# Altium schematic sheet 5_WIFI.schdoc
size 210 x 148 mm; Symbol: tv_muban1_1; Company: 嘉立创EDA; Version: V1.0; Page Size: A4; @Project Name: LCEDAsucaiku; @Update Date: 2026-05-01; @Create Date: 2026-03-27; @Page Name: WIFI; @Page Count: 8; @Page No: 5; @Update Time: 18:57:04; Color: #990000; Device: sucai_muban; @Board Name: tv基板; @Create Time: 22:34:03; @Schematic Name: Schematic1; @Assembly Variant: Basic; Border: 1; Title Block Position: 3; Size: A4; Width: 826; Height: 582; Region Start: 1; X Region Count: 6; Y Region Count: 4; Blade Width: 10; SheetNumber: 5; SheetTotal: 8
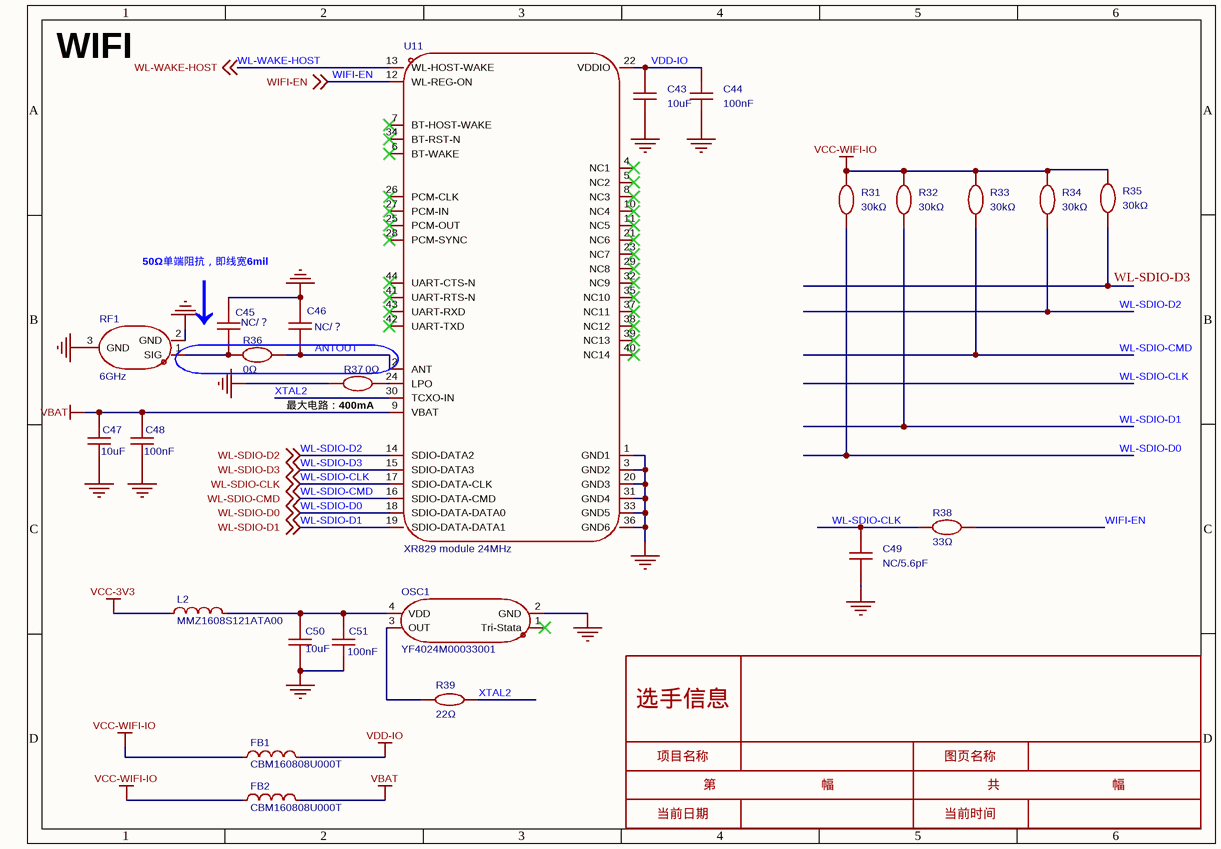
[diagram p0: 5_WIFI.schdoc]

## Parts
C43  10uF  [C0805]
C44  100nF  [C0402]
C45  NC/？  [C0402]
C46  NC/？  [C0402]
C47  10uF  [C0805]
C48  100nF  [C0402]
C49  NC/5.6pF  [C0402]
C50  10uF  [C0805]
C51  100nF  [C0402]
FB1  CBM160808U000T  [L0603]
FB2  CBM160808U000T  [L0603]
L2  MMZ1608S121ATA00  [L0603]
OSC1  YF4024M00033001  [OSC-SMD_4P-L3.2-W2.5-BL_1C210000BB0F]
R31  30kΩ  [R0402]
R32  30kΩ  [R0402]
R33  30kΩ  [R0402]
R34  30kΩ  [R0402]
R35  30kΩ  [R0402]
R36  0Ω  [R0402]
R37  0Ω  [R0402]
R38  33Ω  [R0402]
R39  22Ω  [R0402]
RF1  6GHz  [IPEX-SMD_BWIPX-1-001E]
U11  XR829 module 24MHz  [WIRELM-SMD_XR829-MODULE-24MHZ]

## Blocks framed on the sheet
↓: R36

## Nets
GND: C43.1 C44.1 C45.2 C46.2 C47.1 C48.1 C49.1 C50.1 C51.1 OSC1.2(GND) R37.1 RF1.2(GND) RF1.3(GND) U11.1(GND1) U11.3(GND2) U11.20(GND3) U11.31(GND4) U11.33(GND5) U11.36(GND6)
VBAT: C47.2 C48.2 FB2.2 U11.9(VBAT)
VCC-3V3: L2.1
VCC-WIFI-IO: FB1.1 FB2.1 R31.2 R32.2 R33.2 R34.2 R35.2
VDD-IO: C43.2 C44.2 FB1.2 U11.22(VDDIO)
ANTOUT: C46.1 R36.2 U11.2(ANT)
WIFI-EN: R38.1 U11.12(WL-REG-ON) ; off-sheet WIFI-EN
WL-SDIO-CLK: C49.2 R38.2 U11.17(SDIO-DATA-CLK) ; off-sheet WL-SDIO-CLK
WL-SDIO-CMD: R33.1 U11.16(SDIO-DATA-CMD) ; off-sheet WL-SDIO-CMD
WL-SDIO-D0: R31.1 U11.18(SDIO-DATA-DATA0) ; off-sheet WL-SDIO-D0
WL-SDIO-D1: R32.1 U11.19(SDIO-DATA-DATA1) ; off-sheet WL-SDIO-D1
WL-SDIO-D2: R34.1 U11.14(SDIO-DATA2) ; off-sheet WL-SDIO-D2
WL-SDIO-D3: R35.1 U11.15(SDIO-DATA3) ; off-sheet WL-SDIO-D3
WL-WAKE-HOST: U11.13(WL-HOST-WAKE) ; off-sheet WL-WAKE-HOST
XTAL2: R39.1 U11.30(TCXO-IN)
NetC45_1: C45.1 R36.1 RF1.1(SIG)
NetC50_2: C50.2 C51.2 L2.2 OSC1.4(VDD)
NetOSC1_3: OSC1.3(OUT) R39.2
NetR37_2: R37.2 U11.24(LPO)

Not connected (* = marked no-connect by the designer): OSC1 1(Tri-Stata)*; U11 4(NC1)* 5(NC2)* 6(BT-WAKE)* 7(BT-HOST-WAKE)* 8(NC3)* 10(NC4)* 11(NC5)* 21(NC6)* 23(NC7)* 25(PCM-OUT)* 26(PCM-CLK)* 27(PCM-IN)* 28(PCM-SYNC)* 29(NC8)* 32(NC9)* 34(BT-RST-N)* 35(NC10)* 37(NC11)* 38(NC12)* 39(NC13)* 40(NC14)* 41(UART-RTS-N)* 42(UART-TXD)* 43(UART-RXD)* 44(UART-CTS-N)*

## Notes on the sheet
- WIFI
- (near C45) 50Ω单端阻抗，即线宽6mil
- (near R37) 最大电路：400mA
- 选手信息
- 项目名称
- 第                              幅
- 图页名称
- 共                                幅
- 当前日期
- 当前时间

## Library data of the parts
C43 C47 C50 = CGA0805X5R106K500MT: 容值:10uF;精度:±10%;额定电压:50V;温度系数:X5R;; Manufacturer: HRE(芯声); 3D Model: 1ba041120af144c991958decab20d241聨0819f05c4eef4c71ace90d822a990e87; 3D Model Transform: 78.74,51.181,0,0,0,0,0,0.0005,0; Tolerance: ±10%; Voltage Rating: 50V; Temperature Coefficient: X5R; AddInBom: yes; ModelName: C0805_L2.0-W1.3-H1.3; Symbol: CGA0805X5R106K500MT; Device: CGA0805X5R106K500MT; LCSC Part Name: 10uF ±10% 50V; Supplier Part: C6119889; Manufacturer Part: CGA0805X5R106K500MT; Supplier Footprint: 0805; JLCPCB Part Class: Extended Part; Datasheet: https://item.szlcsc.com/datasheet/CGA0805X5R106K500MT/7062595.html; Supplier: LCSC; Value: 10uF; ConvertToPcb: yes; FootprintName: C0805
C44-C46 C48 C51 = CL05B104KO5NNNC: 容值:100nF;精度:±10%;额定电压:16V;温度系数:X7R;; Manufacturer: SAMSUNG(三星); 3D Model: 36a51122f27c49738f86b3bfa98863e0聨0819f05c4eef4c71ace90d822a990e87; 3D Model Transform: 39.37,19.685,0,0,0,0,0,0,0; Tolerance: ±10%; Voltage Rating: 16V; Temperature Coefficient: X7R; AddInBom: yes; ModelName: C0402_L1.0-W0.5-H0.5; Symbol: CL05B104KO5NNNC; Device: CL05B104KO5NNNC; LCSC Part Name: 100nF ±10% 16V; Manufacturer Part: CL05B104KO5NNNC; Supplier Footprint: 0402; JLCPCB Part Class: Basic Part; Datasheet: https://item.szlcsc.com/datasheet/CL05B104KO5NNNC/1877.html; Supplier: LCSC; ConvertToPcb: yes; FootprintName: C0402
  C44 C48 C51: Supplier Part: C1525; Value: 100nF
  C45 C46: Value: NC/？
C49 = CL05B104KO5NNNC: 容值:100nF;精度:±10%;额定电压:16V;温度系数:X7R;; Manufacturer: SAMSUNG(三星); AddInBom: yes; ModelId: 36a51122f27c49738f86b3bfa98863e0聨0819f05c4eef4c71ace90d822a990e87; ModelName: C0402_L1.0-W0.5-H0.5; ModelTransform: 39.37,19.685,0,0,0,0,0,0,0; Tolerance: ±10%; Voltage Rating: 16V; Temperature Coefficient: X7R; Symbol: CL05B104KO5NNNC; Device: CL05B104KO5NNNC; Value: NC/5.6pF; LCSC Part Name: 100nF ±10% 16V; ManufacturerPart: CL05B104KO5NNNC; Supplier Footprint: 0402; JLCPCB Part Class: Basic Part; Datasheet: https://item.szlcsc.com/datasheet/CL05B104KO5NNNC/1877.html; Supplier: LCSC; ConvertToPcb: yes; FootprintName: C0402
FB1 FB2 = CBM160808U000T: 阻抗@频率:0Ω@100MHz;直流电阻(DCR):10mΩ;; Manufacturer: FH(风华); AddInBom: yes; ModelId: 2bc5ec593d464d6ba9807aec0b5673c2聨0819f05c4eef4c71ace90d822a990e87; ModelName: L0603_L1.6-W0.8-H0.5_BEAD; ModelTransform: 62.992,31.496,0,180,0,0,0.094,0.629,0; DC Resistance(DCR): 10mΩ; Current Rating: 6A; Number of Circuits: 1; Symbol: CBM160808U000T; Device: CBM160808U000T; LCSC Part Name: 单路 0603磁珠 阻抗0Ω@100MHz; SupplierPart: C394410; ManufacturerPart: CBM160808U000T; Supplier Footprint: 0603; JLCPCB Part Class: Extended Part; Datasheet: https://item.szlcsc.com/datasheet/CBM160808U000T/373685.html; Supplier: LCSC; ConvertToPcb: yes; FootprintName: L0603; Impedance @ Frequency: 0Ω@100MHz; Operating Temperature: -55℃~+125℃
L2 = MMZ1608S121ATA00: 阻抗@频率:120Ω@100MHz;误差:±25%;直流电阻(DCR):200mΩ;; Manufacturer: TDK; AddInBom: yes; ModelId: 2bc5ec593d464d6ba9807aec0b5673c2聨0819f05c4eef4c71ace90d822a990e87; ModelName: L0603_L1.6-W0.8-H0.5_BEAD; ModelTransform: 62.992,31.496,0,180,0,0,0.094,0.629,0; Tolerance: ±25%; DC Resistance(DCR): 200mΩ; Current Rating: 500mA; Number of Circuits: 1; Symbol: MMZ1608S121ATA00; Device: MMZ1608S121ATA00; LCSC Part Name: 单路 0603磁珠 阻抗120Ω@100MHz; SupplierPart: C136223; ManufacturerPart: MMZ1608S121ATA00; Supplier Footprint: 0603; JLCPCB Part Class: Extended Part; Datasheet: https://item.szlcsc.com/datasheet/MMZ1608S121ATA00/147538.html; Supplier: LCSC; ConvertToPcb: yes; FootprintName: L0603; Impedance @ Frequency: 120Ω@100MHz; Operating Temperature: -55℃~+125℃
OSC1 = YF4024M00033001: Manufacturer: HUAXIN(华昕); AddInBom: yes; ModelId: abac09874cf942b1977c54e82ea110d7聨0819f05c4eef4c71ace90d822a990e87; ModelTransform: 126.063,98.504,0,0,0,0,0,0,0; Symbol: YF4024M00033001; Device: YF4024M00033001; LCSC Part Name: 24M ±20ppm 1.8~3.3V; SupplierPart: C7503132; ManufacturerPart: YF4024M00033001; Supplier Footprint: SMD3225-4P; JLCPCB Part Class: Extended Part; Datasheet: https://item.szlcsc.com/datasheet/YF4024M00033001/8591324.html; Supplier: LCSC; ConvertToPcb: yes; FootprintName: OSC-SMD_4P-L3.2-W2.5-BL_1C210000BB0F; ModelName: OSC-SMD_4P-L3.2-W2.5-BL_1C210000BB0F
R31-R35 = FRC0402F3002TS: 电阻类型:厚膜电阻;阻值:30kΩ;精度:±1%;功率:62.5mW;工作电压:50V;温度系数:±100ppm/℃;; Manufacturer: FOJAN(富捷); AddInBom: yes; ModelId: 98c88bc2b9094f218f3a3e30a7012738聨0819f05c4eef4c71ace90d822a990e87; ModelName: R0402_L1.0-W0.5-H0.4; ModelTransform: 39.37,19.685,0,0,0,0,0,0,0; Tolerance: ±1%; Power(Watts): 62.5mW; Voltage-Supply(Max): 50V; Symbol: FRC0402F3002TS; Device: FRC0402F3002TS; LCSC Part Name: 30kΩ ±1% 62.5mW 厚膜电阻; SupplierPart: C2909347; ManufacturerPart: FRC0402F3002TS; Supplier Footprint: 0402; JLCPCB Part Class: Extended Part; Supplier: LCSC; ConvertToPcb: yes; FootprintName: R0402; Type: 厚膜电阻; Value: 30kΩ; Temperature Coefficient: ±100ppm/℃; Operating Temperature: -55℃~+155℃
R36 R37 = FRC0402P000 TS: 电阻类型:厚膜电阻;阻值:0Ω;精度:±5%;功率:62.5mW;工作电压:50V;; Manufacturer: FOJAN(富捷); 3D Model: 98c88bc2b9094f218f3a3e30a7012738聨0819f05c4eef4c71ace90d822a990e87; 3D Model Transform: 39.37,19.685,0,0,0,0,0,0,0; Tolerance: ±5%; Power(Watts): 62.5mW; Voltage-Supply(Max): 50V; AddInBom: yes; ModelName: R0402_L1.0-W0.5-H0.4; Symbol: FRC0402P000 TS; Device: FRC0402P000 TS; LCSC Part Name: 0Ω ±5% 62.5mW 厚膜电阻; Supplier Part: C2906877; Manufacturer Part: FRC0402P000 TS; Supplier Footprint: 0402; JLCPCB Part Class: Extended Part; Supplier: LCSC; Type: 厚膜电阻; Value: 0Ω; Operating Temperature: -55℃~+155℃; ConvertToPcb: yes; FootprintName: R0402
R38 = FRC0402F33R0TS: 电阻类型:厚膜电阻;阻值:33Ω;精度:±1%;功率:62.5mW;工作电压:50V;温度系数:±100ppm/℃;; Manufacturer: FOJAN(富捷); AddInBom: yes; ModelId: 98c88bc2b9094f218f3a3e30a7012738聨0819f05c4eef4c71ace90d822a990e87; ModelName: R0402_L1.0-W0.5-H0.4; ModelTransform: 39.37,19.685,0,0,0,0,0,0,0; Tolerance: ±1%; Power(Watts): 62.5mW; Voltage-Supply(Max): 50V; Symbol: FRC0402F33R0TS; Device: FRC0402F33R0TS; LCSC Part Name: 33Ω ±1% 62.5mW 厚膜电阻; SupplierPart: C2906868; ManufacturerPart: FRC0402F33R0TS; Supplier Footprint: 0402; JLCPCB Part Class: Extended Part; Supplier: LCSC; ConvertToPcb: yes; FootprintName: R0402; Type: 厚膜电阻; Value: 33Ω; Temperature Coefficient: ±100ppm/℃; Operating Temperature: -55℃~+155℃
R39 = 0402WGF220JTCE: 电阻类型:厚膜电阻;阻值:22Ω;精度:±1%;功率:62.5mW;最大工作电压:50V;温度系数:±100ppm/℃;; Manufacturer: UNI-ROYAL(厚声); AddInBom: yes; ModelId: 98c88bc2b9094f218f3a3e30a7012738聨0819f05c4eef4c71ace90d822a990e87; ModelName: R0402_L1.0-W0.5-H0.4; ModelTransform: 39.37,19.685,0,0,0,0,0,0,0; Tolerance: ±1%; Power(Watts): 62.5mW; Overload Voltage (Max): 50V; Symbol: 0402WGF220JTCE; Device: 0402WGF220JTCE; LCSC Part Name: 22Ω ±1% 62.5mW 厚膜电阻; SupplierPart: C25092; ManufacturerPart: 0402WGF220JTCE; Supplier Footprint: 0402; JLCPCB Part Class: Basic Part; Datasheet: https://atta.szlcsc.com/upload/public/pdf/source/20200306/C422600_1E6D84923E4A46A82E41ADD87F860B5C.pdf; Supplier: LCSC; ConvertToPcb: yes; FootprintName: R0402; Type: 厚膜电阻; Value: 22Ω; Temperature Coefficient: ±100ppm/℃; Operating Temperature Range: -55℃~+155℃
RF1 = BWIPX-1-001E: 连接器类型:板端;接口类型:内针;端口数量:1;接口直径:2mm;接口长度/高度:1.25mm;频率:6GHz;射频系列:IPEX;阻抗:50Ω;样式:-;工作温度:-40℃~+85℃;; Manufacturer: BAT WIRELESS(蝙蝠无线); 3D Model: e9910d1cc3f644ef905f39c3184653d7聨0819f05c4eef4c71ace90d822a990e87; 3D Model Transform: 122.047,118.11,0,180,0,0,29.921,0,0; Connector Type: 板端; Interface: 内针; Number of Ports: 1; Interface Diameter: 2mm; Interface Length/Height: 1.25mm; RF Series: IPEX; Impedance: 50Ω; AddInBom: yes; Symbol: BWIPX-1-001E; Device: BWIPX-1-001E; LCSC Part Name: 内针 IPEX; Supplier Part: C496552; Manufacturer Part: BWIPX-1-001E; Supplier Footprint: SMD; JLCPCB Part Class: Extended Part; Datasheet: https://item.szlcsc.com/datasheet/BWIPX-1-001E/508501.html; Supplier: LCSC; Value: 6GHz; Style: -; Operating Temperature Range: -40℃~+85℃; ConvertToPcb: yes; FootprintName: IPEX-SMD_BWIPX-1-001E; ModelName: IPEX-SMD_BWIPX-1-001E
U11 = XR829 module 24MHz: Manufacturer: x-powers; AddInBom: yes; ModelId: 04a79f9e2d454222904379cc9ddf09c8聨0819f05c4eef4c71ace90d822a990e87; ModelTransform: 472.44,472.44,0,0,0,0,-0.004,0,0; Symbol: XR829 MODULE 24MHZ; Device: XR829 module 24MHz; FootprintName: WIRELM-SMD_XR829-MODULE-24MHZ; LCSC Part Name: XR829 module 24MHz; SupplierPart: C5365288; ManufacturerPart: XR829 module 24MHz; Supplier Footprint: SMD,12x12mm; JLCPCB Part Class: Extended Part; Datasheet: https://item.szlcsc.com/datasheet/XR829%2520module%252024MHz/6196369.html; Supplier: LCSC; ConvertToPcb: yes; ModelName: WIRELM-SMD_XR829-MODULE-24MHZ